# Altium schematic sheet RK3399_PMU.SchDoc
size B; Organization: Altium Limited; Address1: L3, 12a Rodborough Rd; Address2: Frenchs Forest; Address3: NSW; Address4: Australia 2086
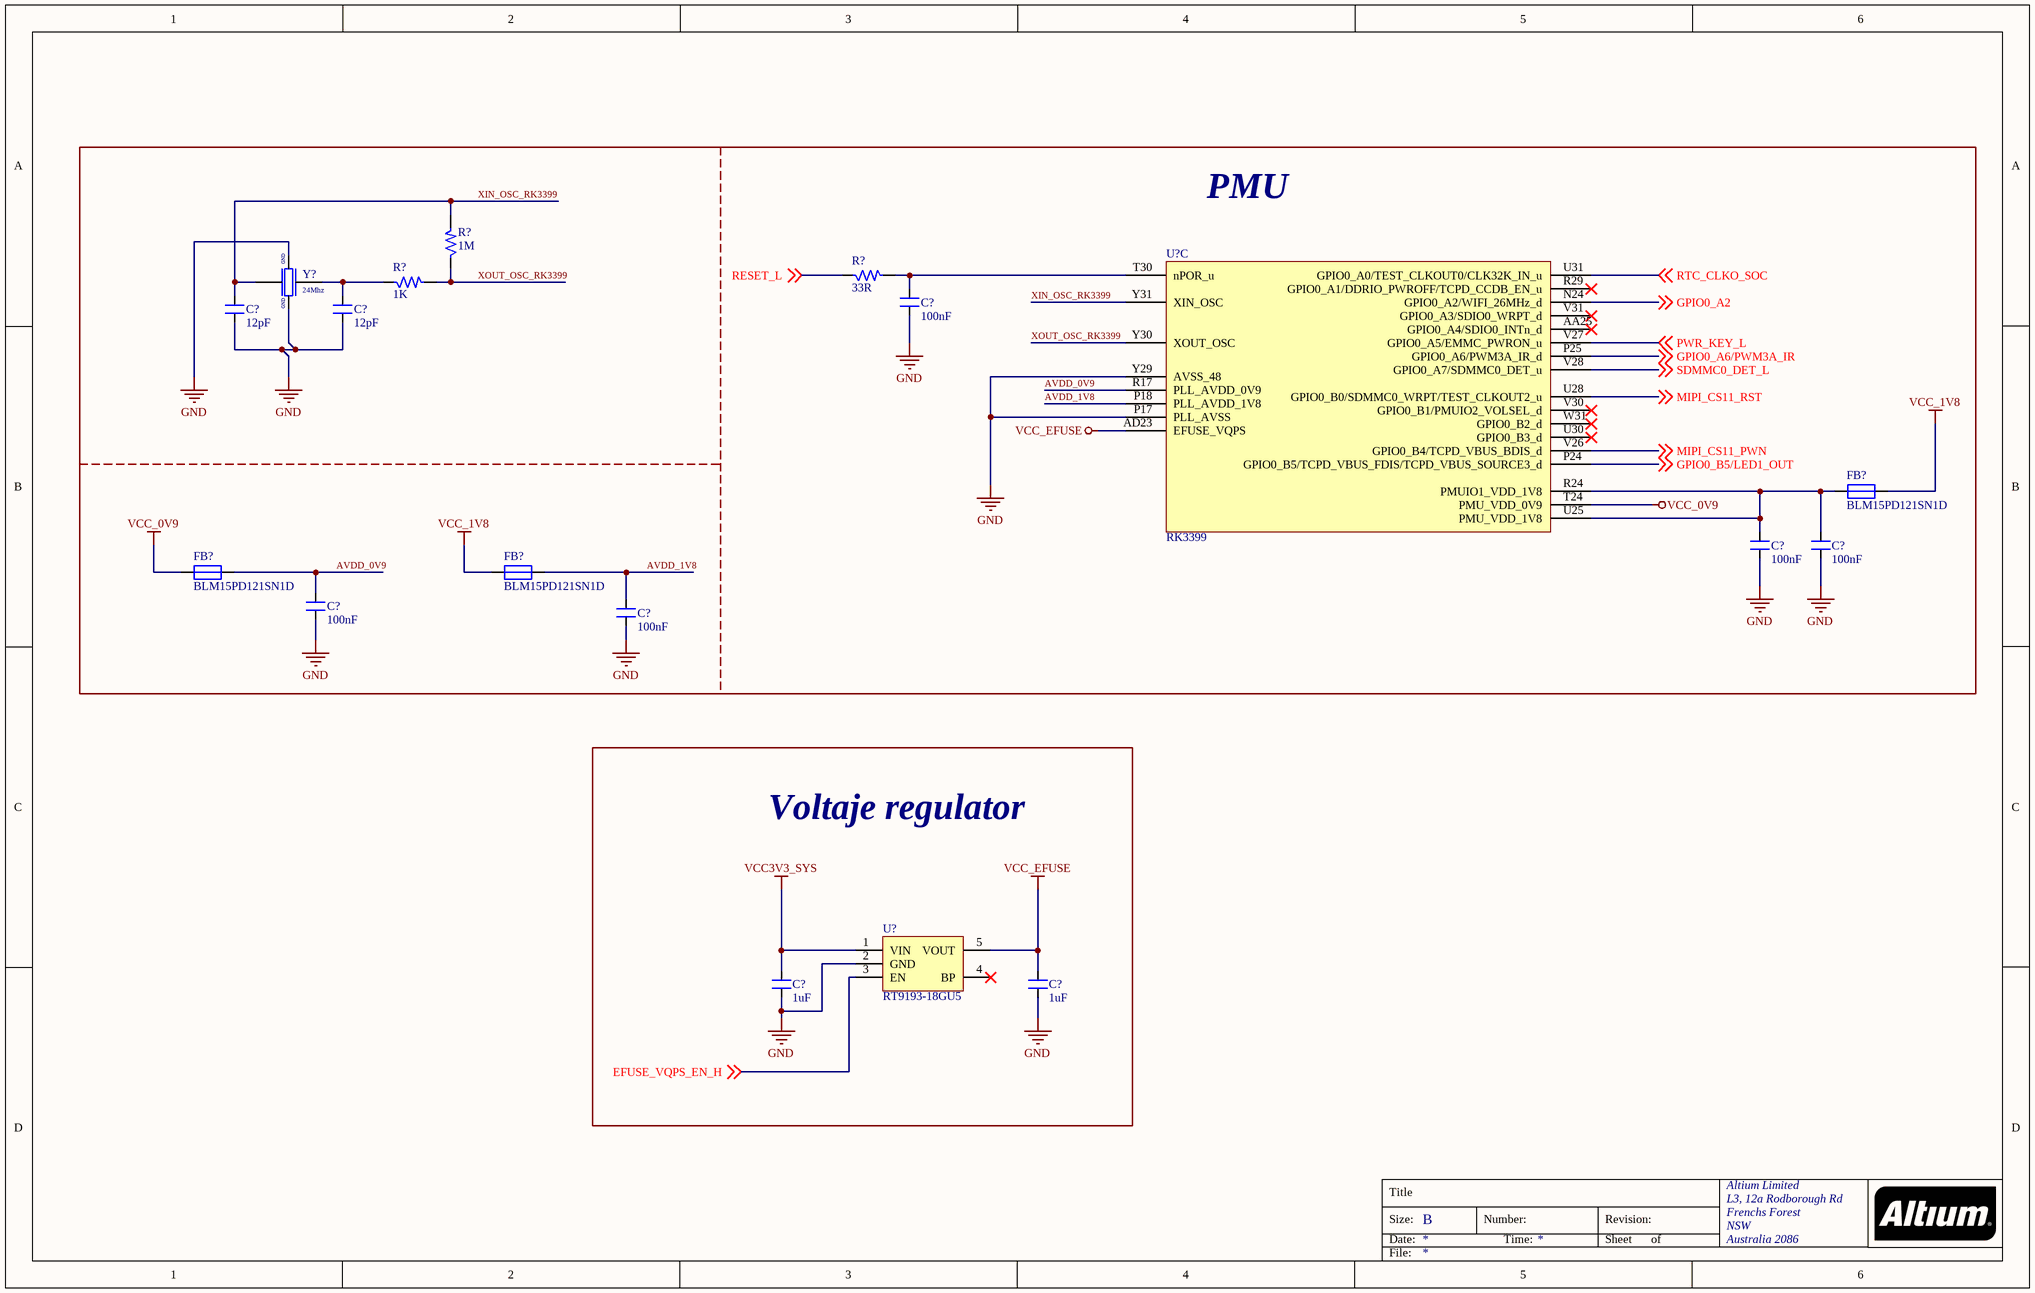
[diagram p0: RK3399_PMU.SchDoc]

## Parts
(Parts that share a designator on the sheet are numbered #1, #2 ... from top to bottom, then left to right.)
C?#1  100nF  [CAP_0201]
C?#2  12pF  [CAP_0201]
C?#3  12pF  [CAP_0201]
C?#4  100nF  [CAP_0201]
C?#5  100nF  [CAP_0201]
C?#6  100nF  [CAP_0201]
C?#7  100nF  [CAP_0201]
C?#8  1uF  [CAP_0201]
C?#9  1uF  [CAP_0201]
FB?#1  BLM15PD121SN1D  [RES_0402]
FB?#2  BLM15PD121SN1D  [RES_0402]
FB?#3  BLM15PD121SN1D  [RES_0402]
R?#1  1M  [RES_0201]
R?#2  33R  [RES_0201]
R?#3  1K  [RES_0201]
U?#1  RK3399  [FBGA828_23_826X826]  (part C of 24)
U?#2  RT9193-18GU5  [SC70-5]
Y?  24Mhz  [XTAL_ABM8AIG-24.000MHZ-12-2Z-T3]

## Blocks framed on the sheet
PMU: C?#1-C?#7 FB?#1-FB?#3 R?#1-R?#3 U?#1 Y?
Voltaje regulator: C?#8 C?#9 U?#2

## Nets
GND: C?#1.1 C?#2.1 C?#3.1 C?#4.1 C?#5.1 C?#6.1 C?#7.1 C?#8.1 C?#9.1 U?#1.P17(PLL_AVSS) U?#1.Y29(AVSS_48) U?#2.2(GND) Y?.2 Y?.4
VCC3V3_SYS: C?#8.2 U?#2.1(VIN)
VCC_0V9: FB?#2.1 U?#1.T24(PMU_VDD_0V9)
VCC_1V8: FB?#1.2 FB?#3.1
VCC_EFUSE: C?#9.2 U?#1.AD23(EFUSE_VQPS) U?#2.5(VOUT)
AVDD_0V9: C?#6.2 FB?#2.2 U?#1.R17(PLL_AVDD_0V9)
AVDD_1V8: C?#7.2 FB?#3.2 U?#1.P18(PLL_AVDD_1V8)
EFUSE_VQPS_EN_H: U?#2.3(EN) ; off-sheet EFUSE_VQPS_EN_H
GPIO0_A2: U?#1.N24(GPIO0_A2/WIFI_26MHz_d) ; off-sheet GPIO0_A2
GPIO0_A6/PWM3A_IR: U?#1.P25(GPIO0_A6/PWM3A_IR_d) ; off-sheet GPIO0_A6/PWM3A_IR
GPIO0_B5/LED1_OUT: U?#1.P24(GPIO0_B5/TCPD_VBUS_FDIS/TCPD_VBUS_SOURCE3_d) ; off-sheet GPIO0_B5/LED1_OUT
MIPI_CS11_PWN: U?#1.V26(GPIO0_B4/TCPD_VBUS_BDIS_d) ; off-sheet MIPI_CS11_PWN
MIPI_CS11_RST: U?#1.U28(GPIO0_B0/SDMMC0_WRPT/TEST_CLKOUT2_u) ; off-sheet MIPI_CS11_RST
PWR_KEY_L: U?#1.V27(GPIO0_A5/EMMC_PWRON_u) ; off-sheet PWR_KEY_L
RESET_L: R?#2.1 ; off-sheet RESET_L
RTC_CLKO_SOC: U?#1.U31(GPIO0_A0/TEST_CLKOUT0/CLK32K_IN_u) ; off-sheet RTC_CLKO_SOC
SDMMC0_DET_L: U?#1.V28(GPIO0_A7/SDMMC0_DET_u) ; off-sheet SDMMC0_DET_L
XIN_OSC_RK3399: C?#2.2 R?#1.2 U?#1.Y31(XIN_OSC) Y?.1
XOUT_OSC_RK3399: R?#1.1 R?#3.2 U?#1.Y30(XOUT_OSC)
NetC?#1_2: C?#1.2 R?#2.2 U?#1.T30(nPOR_u)
NetC?#3_2: C?#3.2 R?#3.1 Y?.3
NetC?#4_2: C?#4.2 C?#5.2 FB?#1.1 U?#1.R24(PMUIO1_VDD_1V8) U?#1.U25(PMU_VDD_1V8)

Not connected (* = marked no-connect by the designer): U?#1 AA25(GPIO0_A4/SDIO0_INTn_d)* R29(GPIO0_A1/DDRIO_PWROFF/TCPD_CCDB_EN_u)* U30(GPIO0_B3_d)* V30(GPIO0_B1/PMUIO2_VOLSEL_d)* V31(GPIO0_A3/SDIO0_WRPT_d)* W31(GPIO0_B2_d)*; U?#2 4(BP)*

## Notes on the sheet
- Title
- Size:
- Date:
- B
- Number:
- Time:
- Revision:
- Sheet
- of
- File:
- (in symbol XTAL_24Mhz-12pF-4-SMD) GND

## Library data of the parts
C?#1 C?#4-C?#7 = CAP_100nF-25V-10%-0201: 0.1µF ±10% 25V Ceramic Capacitor X5R 0201 (0603 Metric) /; Manufacturer: TDK Corporation; Manufacturer Part Number: C0603X5R1E104K030BB; Case/Package: 0201; Supplier-1: Digikey
C?#2 C?#3 = CAP_12pF-16V-10%-0201: 12pF ±10% 16V Ceramic Capacitor C0G, NP0 0201 (0603 Metric) /; Manufacturer: AVX Corporation; Manufacturer Part Number: 0201YA120KAT2A; Case/Package: 0201; Supplier-1: Digikey
C?#8 C?#9 = CAP_1uF-16V-10%-0201: 1µF ±20% 16V Ceramic Capacitor X5R 0201 (0603 Metric) /; Manufacturer: Samsung Electro-Mechanics; Manufacturer Part Number: CL03A105MO3NRNH; Case/Package: 0201; Supplier-1: Digikey
FB?#1-FB?#3 = FB_120R-1.3A-100Mhz-0402: 120 Ohms @ 100MHz 1 Power Line Ferrite Bead 0402 (1005 Metric) 1.3A 90mOhm; Manufacturer: Murata Electronics; Mnaufacturer Part Number: BLM15PD121SN1D; Case/Package: 0402; Supplier-1: Digikey
R?#1 = RES_1M-0.05W-1%-0201: 1 MOhms ±1% 0.05W, 1/20W Chip Resistor 0201 (0603 Metric) Thick Film /; Manufacturer: Yageo; Manufacturer Part Number: RC0201FR-071ML; Case/Package: 0201; Supplier-1: Digikey
R?#2 = RES_33R-0.05W-1%-0201: 33 Ohms ±1% 0.05W, 1/20W Chip Resistor 0201 (0603 Metric) Thick Film /; Manufacturer: Yageo; Manufacturer Part Number: RC0201FR-0733RL; Case/Package: 0201; Supplier-1: Digikey
R?#3 = RES_1K-0.05W-1%-0201: 1 kOhms ±1% 0.05W, 1/20W Chip Resistor 0201 (0603 Metric) Thick Film /; Manufacturer: Yageo; Manufacturer Part Number: RC0201FR-071KL; Case/Package: 0201; Supplier-1: Digikey
U?#1 = IC_RK3399-FCBGA828: RK3399 is a low power, high performance processor for computing, personal mobile.; Manufacturer: Rockchip; Manufacturer Part Number: RK3399; Case/Package: FCBGA828; Supplier-1: Rockchip
U?#2 = REG_1.8V-300mA-5.5V-SC70-5: Linear Voltage Regulator IC 1 Output 300mA SC-70-5; Manufacturer: Richtek USA Inc.; Manufacturer Part Number: RT9193-18GU5; Case/Package: SC70-5; Supplier-1: Digikey
Y? = XTAL_24Mhz-12pF-4-SMD: 24MHz ±20ppm Crystal 12pF 50 Ohms 4-SMD, No Lead /; Manufacturer: Abracon LLC; Manufacturer Part Number: ABM8AIG-24.000MHZ-12-2Z-T3; Case/Package: SMD; Supplier-1: Digikey